# EasyEDA Pro project bandolibre.eprj, schematic GroundSwitch
Board Name: GroundSwitch; Create Date: 2026-05-26; Page Name: P1; Project Name: bandoneo; Schematic Name: GroundSwitch; Update Date: 2026-05-28; Company: EasyEDA.com; Page Size: A4; Version: V1.0
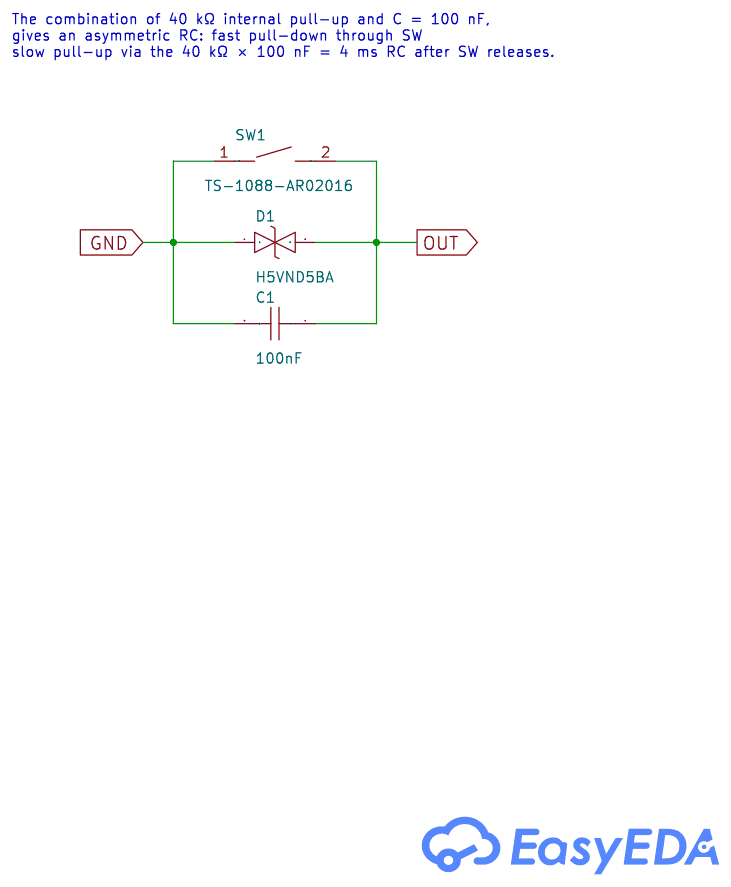
[diagram p2: schematic sheet]

## Parts
C1  100nF  [C0603]
D1  H5VND5BA  [SOD-523_L1.2-W0.8-LS1.6-BI]
SW1  TS-1088-AR02016  [SW-SMD_L3.9-W3.0-P4.45]

## Library data of the parts
C1 = CC0603KRX7R9BB104: Capacitance: Tolerance:±10% Tolerance:±10% Voltage Rated: Temperature Coefficient:; LCSC Part Name: 100nF ±10% 50V; Supplier Part: C14663; Manufacturer: YAGEO(国巨); Supplier Footprint: 0603; JLCPCB Part Class: Basic Part; Datasheet: https://atta.szlcsc.com/upload/public/pdf/source/20170116/1484561234239.pdf; Supplier: LCSC; Tolerance: ±10%
D1 = H5VND5BA: Polarity:Bidirectional Reverse Stand-Off Voltage (Vrwm):5V Clamping Voltage:15V Peak Pulse Current (Ipp):8A@8/20us Peak Pulse Power Dissipation (Ppp):120W@8/20us Voltage - Breakdown:8V Reverse Leakage Current (Ir):200nA Number of Channels:1 Operating Temp; LCSC Part Name: 双向ESD 5V截止 峰值浪涌电流：8A@8/20us; Supplier Part: C42413899; Manufacturer: R+O(宏嘉诚); Supplier Footprint: SOD-523; JLCPCB Part Class: Extended Part; Datasheet: https://item.szlcsc.com/datasheet/H5VND5BA/44403780.html; Supplier: LCSC; Polarity: Bidirectional; Reverse Stand-Off Voltage (Vrwm): 5V; Clamping Voltage: 15V; Peak Pulse Current (Ipp): 8A@8/20us; Peak Pulse Power Dissipation (Ppp): 120W@8/20us; Voltage - Breakdown: 8V; Reverse Leakage Current (Ir): 200nA; Number of Channels: 1; Operating Temperature: -55℃~+125℃; level of protection: IEC 61000-4-2；IEC 61000-4-5; Type: ESD; Junction Capacitance: 20pF
SW1 = TS-1088-AR02016: Circuit:SPST Actuator Style:Round Button Operating Force:160gf Mounting Style:Brick nogging Switch Length:4mm Switch Width:3mm Switch Height:2mm Strike Gundam:不带 Contact Current:50mA Voltage Rating (DC):12V Insulation Resistance:100MΩ Actuator/Cap Color:B; LCSC Part Name: 4*3*2mm 立贴 轻触开关; Supplier Part: C720477; Manufacturer: XUNPU(讯普); Supplier Footprint: SMD; JLCPCB Part Class: Basic Part; Datasheet: https://atta.szlcsc.com/upload/public/pdf/source/20200810/C720475_60D09DD6C54279ADDB2DC25100F1CC11.pdf; Supplier: LCSC; Circuit: SPST; Actuator Style: Round Button; Operating Force: 160gf; Mounting Style: Brick nogging; Switch Length: 4mm; Switch Width: 3mm; Switch Height: 2mm; Strike Gundam: 不带; Contact Current: 50mA; Voltage Rating (DC): 12V; Insulation Resistance: 100MΩ; Actuator/Cap Color: Black; Pin Style: SMDSplicing; Mechanical Life: 10万次; Operating Temperature: -30℃~+80℃

## Nets
GND: C1.2 D1.1 SW1.1
OUT: C1.1 D1.2 SW1.2

## Notes on the sheet
- The combination of 40 kΩ internal pull-up and C = 100 nF,
  gives an asymmetric RC: fast pull-down through SW
  slow pull-up via the 40 kΩ × 100 nF = 4 ms RC after SW releases.
